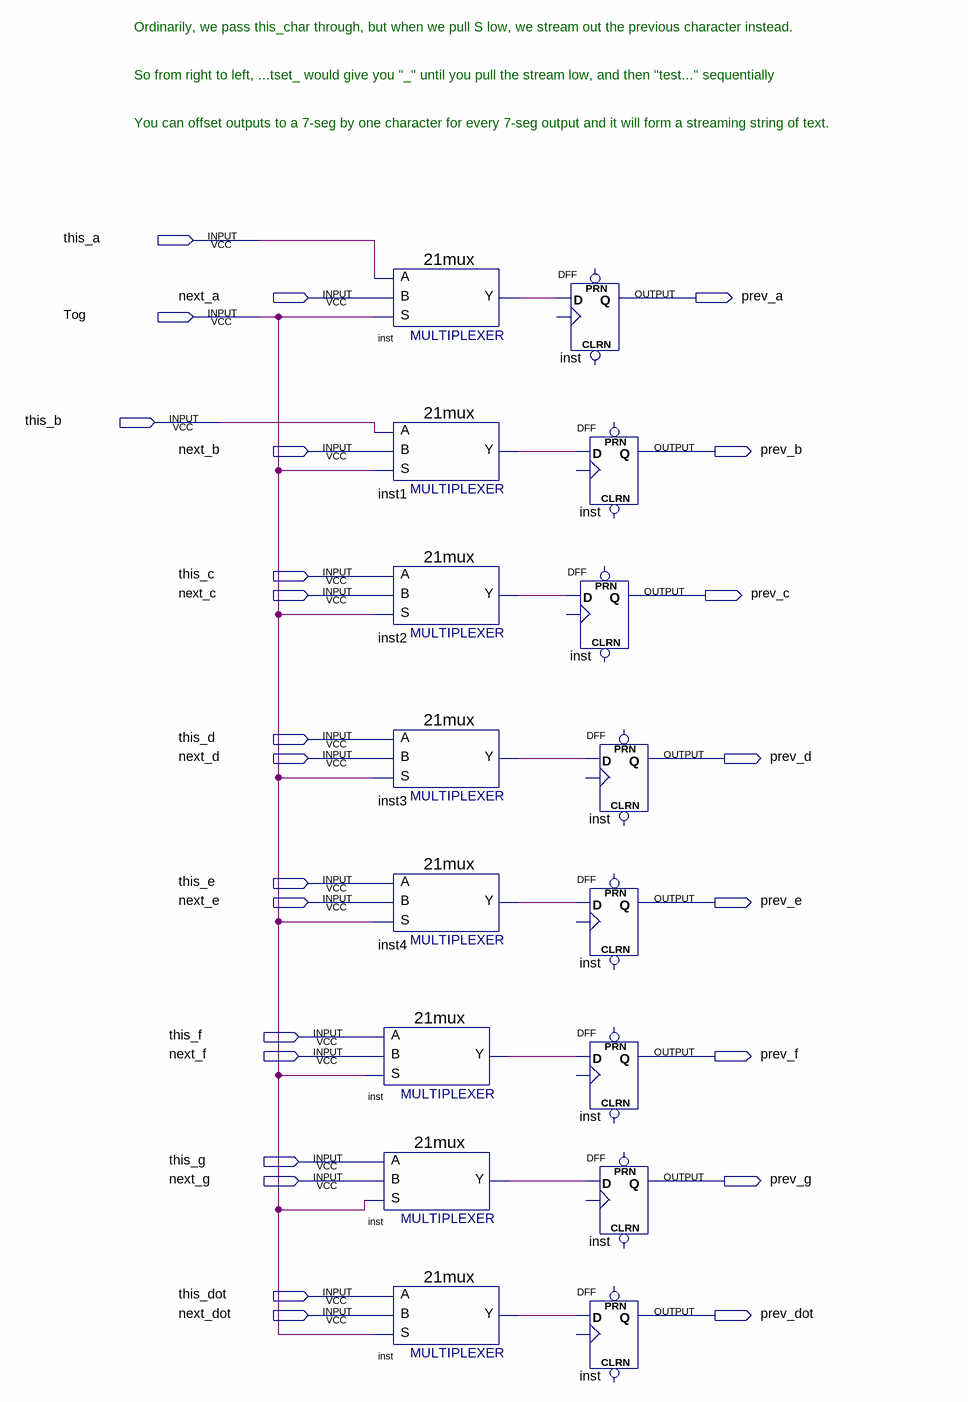
[diagram p0: schematic sheet]
// Quartus schematic const_char.bdf as structural Verilog: 16 symbols, 25 pins
module const_char (
  input  this_a,
  input  next_a,
  input  Tog,
  input  this_b,
  input  next_b,
  input  this_c,
  input  next_c,
  input  this_d,
  input  next_d,
  input  this_e,
  input  next_e,
  input  this_f,
  input  next_f,
  input  this_g,
  input  next_g,
  input  this_dot,
  input  next_dot,
  output prev_a,
  output prev_b,
  output prev_c,
  output prev_d,
  output prev_e,
  output prev_f,
  output prev_g,
  output prev_dot
);

  wire inst1_y, inst2_y, inst3_y, inst4_y, inst_y, inst_y_2, inst_y_3, inst_y_4;

  \21mux  inst (.S(Tog), .B(next_a), .A(this_a), .Y(inst_y));
  \21mux  inst1 (.S(Tog), .B(next_b), .A(this_b), .Y(inst1_y));
  \21mux  inst2 (.S(Tog), .B(next_c), .A(this_c), .Y(inst2_y));
  \21mux  inst3 (.S(Tog), .B(next_d), .A(this_d), .Y(inst3_y));
  \21mux  inst4 (.S(Tog), .B(next_e), .A(this_e), .Y(inst4_y));
  \21mux  inst_dup2 (.S(Tog), .B(next_f), .A(this_f), .Y(inst_y_2));
  \21mux  inst_dup3 (.S(Tog), .B(next_g), .A(this_g), .Y(inst_y_3));
  \21mux  inst_dup4 (.S(Tog), .B(next_dot), .A(this_dot), .Y(inst_y_4));
  DFF inst_dup5 (.D(inst_y), .Q(prev_a));  // open: CLRN, CLK, PRN
  DFF inst_dup6 (.D(inst2_y), .Q(prev_c));  // open: CLRN, CLK, PRN
  DFF inst_dup7 (.D(inst1_y), .Q(prev_b));  // open: CLRN, CLK, PRN
  DFF inst_dup8 (.D(inst3_y), .Q(prev_d));  // open: CLRN, CLK, PRN
  DFF inst_dup9 (.D(inst4_y), .Q(prev_e));  // open: CLRN, CLK, PRN
  DFF inst_dup10 (.D(inst_y_2), .Q(prev_f));  // open: CLRN, CLK, PRN
  DFF inst_dup11 (.D(inst_y_3), .Q(prev_g));  // open: CLRN, CLK, PRN
  DFF inst_dup12 (.D(inst_y_4), .Q(prev_dot));  // open: CLRN, CLK, PRN

  // Notes on the sheet:
  //   Ordinarily, we pass this_char through, but when we pull S low, we stream out the previous character instead.
  //   So from right to left, ...tset_ would give you "_" until you pull the stream low, and then "test..." sequentially
  //   You can offset outputs to a 7-seg by one character for every 7-seg output and it will form a streaming string of text.
endmodule
